# Altium project logic_board.PrjPcb
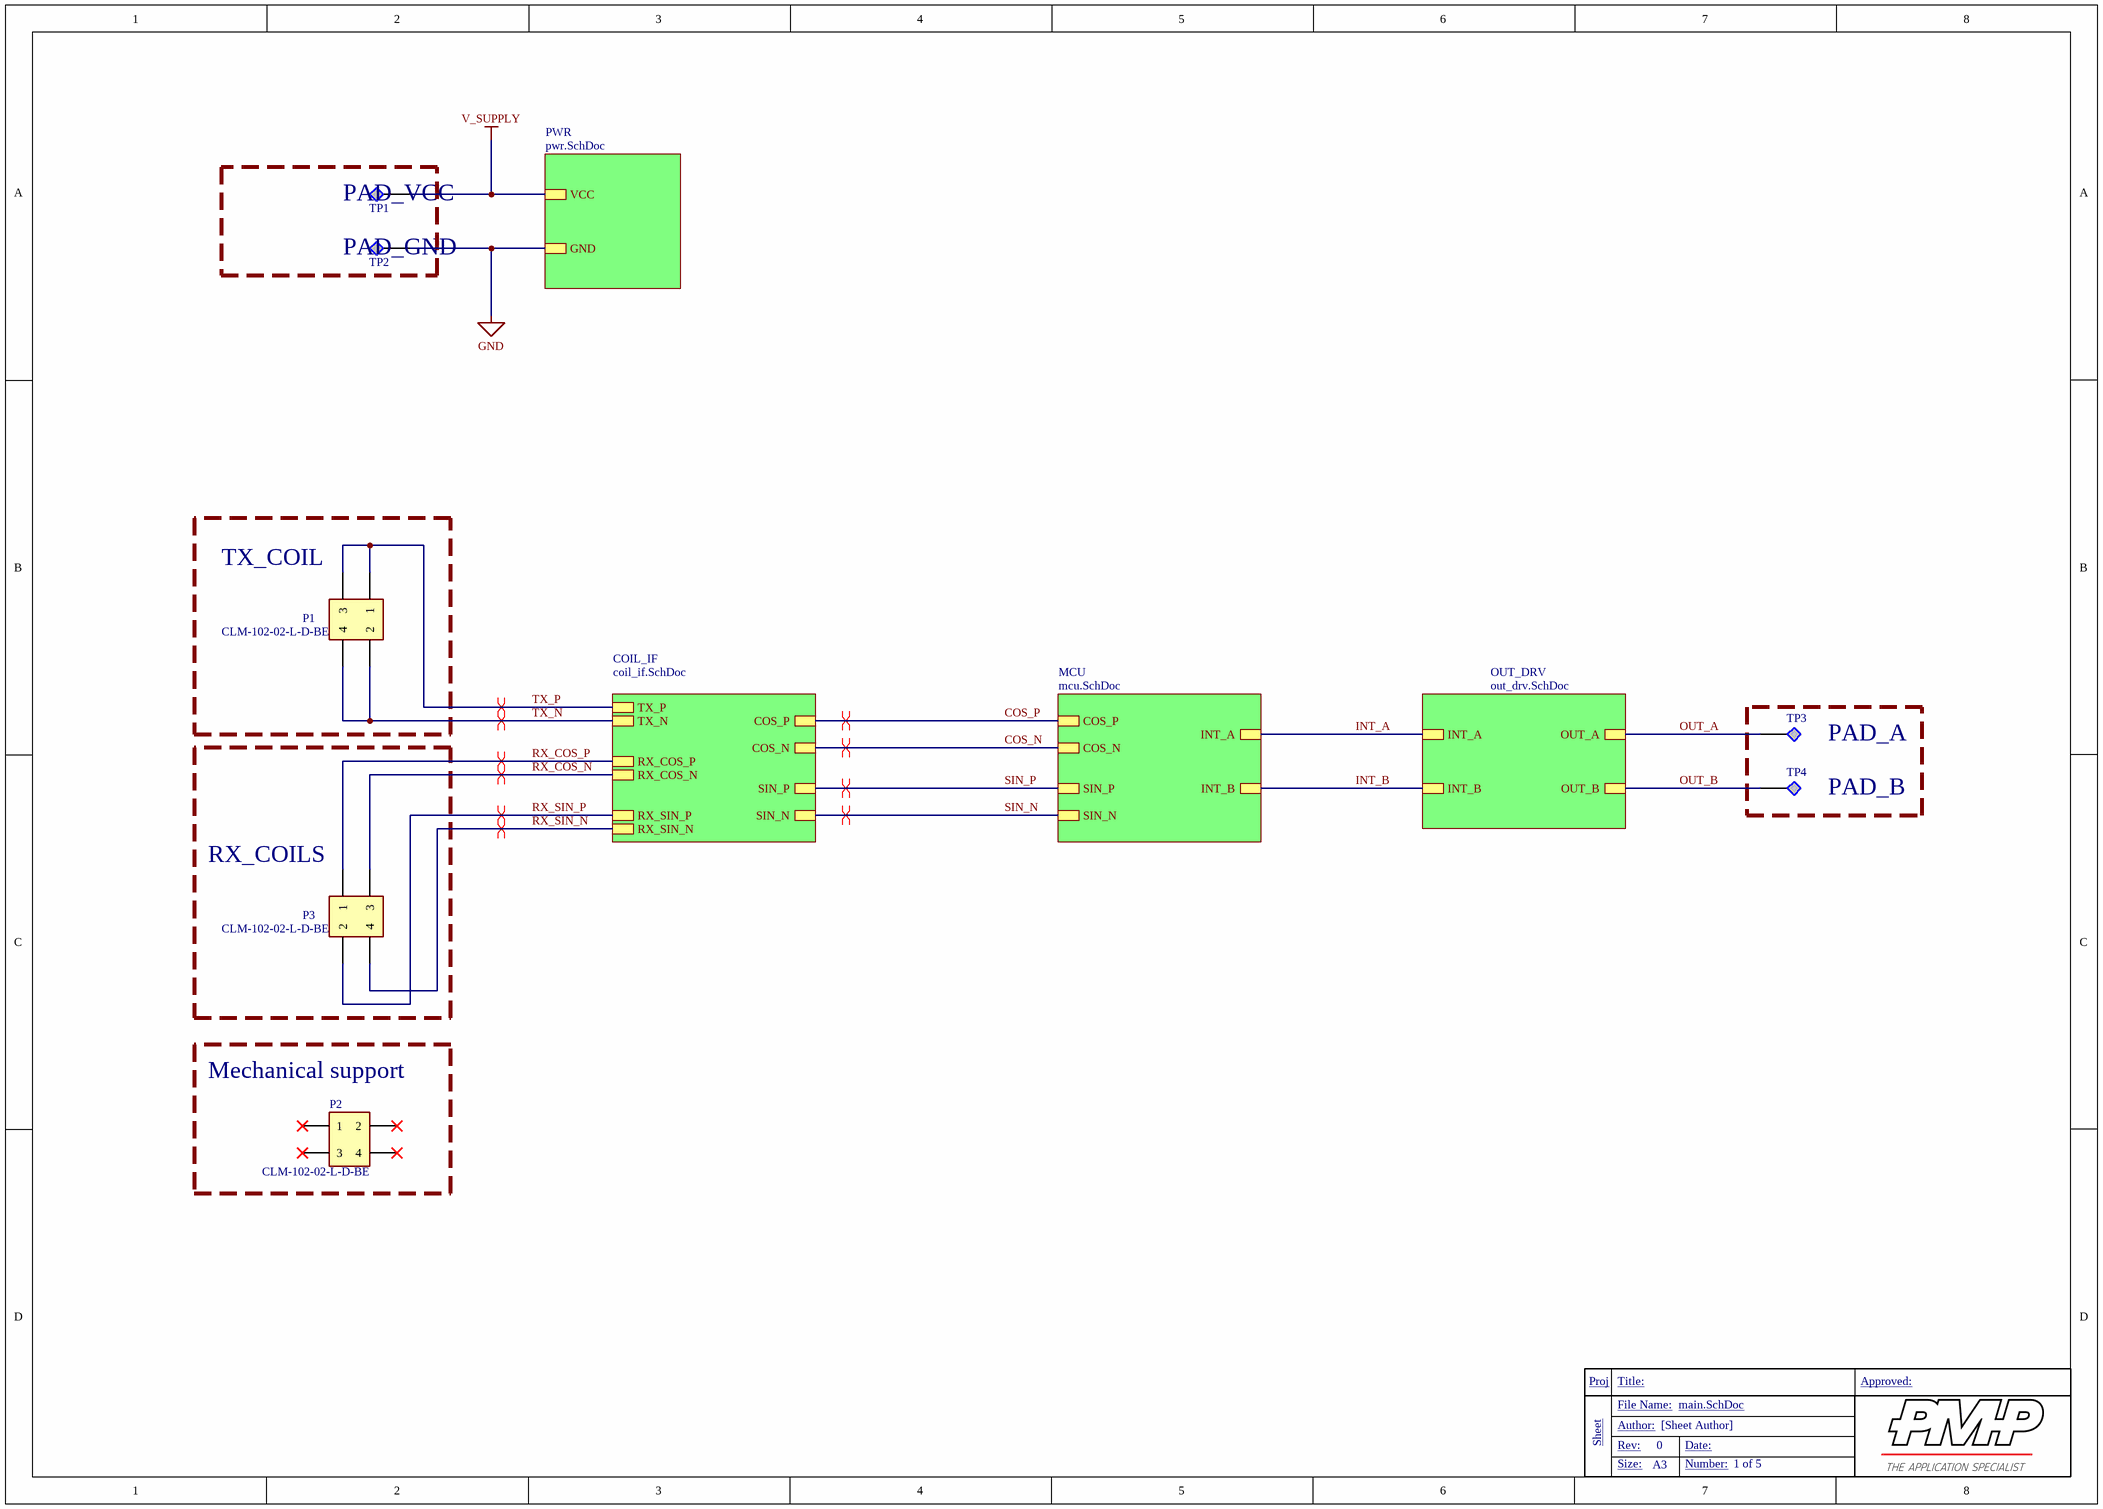
[diagram p0: main.SchDoc]
5 sheets, 71 parts. Net scope: hierarchical (ports join the sheet entries above them; power ports are global).
Board files: PCB1_w_gnd_plane.PcbDoc, PCB1_wo_gnd_plane.PcbDoc
Sheets:
  main.SchDoc
    PWR = pwr.SchDoc
    OUT_DRV = out_drv.SchDoc
    MCU = mcu.SchDoc
    COIL_IF = coil_if.SchDoc

## Sheet main.SchDoc: =ProjectName+'_'+Revision+'_'+VariantName
size A3; Author: [Sheet Author]; DocumentNumber: 1; Revision: 0; SheetNumber: 1; SheetTotal: 5

### Parts
P1  CLM-102-02-L-D-BE  [SAMTEC_CLM-102-02-X-D-BE_SPECIAL]
P2  CLM-102-02-L-D-BE  [SAMTEC_CLM-102-02-X-D-BE_SPECIAL]
P3  CLM-102-02-L-D-BE  [SAMTEC_CLM-102-02-X-D-BE_SPECIAL]
TP1  Term Pole  [Terminale 508-0685_2mm]  (value not drawn)
TP2  Term Pole  [Terminale 508-0685_2mm]  (value not drawn)
TP3  Term Pole  [Terminale 508-0685_2mm]  (value not drawn)
TP4  Term Pole  [Terminale 508-0685_2mm]  (value not drawn)

### Blocks framed on the sheet
TX_COIL: P1
RX_COILS: P3
Mechanical support: P2

### Sub-sheets
COIL_IF = coil_if.SchDoc: COS_P, COS_N, TX_P, TX_N, RX_COS_N, RX_COS_P, SIN_N, SIN_P, RX_SIN_N, RX_SIN_P
MCU = mcu.SchDoc: INT_A, INT_B, COS_P, COS_N, SIN_N, SIN_P
OUT_DRV = out_drv.SchDoc: OUT_A, OUT_B, INT_A, INT_B
PWR = pwr.SchDoc: GND, VCC

### Nets
GND: TP2.1 ; sheet PWR/GND
V_SUPPLY: TP1.1 ; sheet PWR/VCC
COS_N: sheet MCU/COS_N, sheet COIL_IF/COS_N
COS_P: sheet MCU/COS_P, sheet COIL_IF/COS_P
INT_A: sheet OUT_DRV/INT_A, sheet MCU/INT_A
INT_B: sheet OUT_DRV/INT_B, sheet MCU/INT_B
OUT_A: TP3.1 ; sheet OUT_DRV/OUT_A
OUT_B: TP4.1 ; sheet OUT_DRV/OUT_B
RX_COS_N: P3.03(3) ; sheet COIL_IF/RX_COS_N
RX_COS_P: P3.01(1) ; sheet COIL_IF/RX_COS_P
RX_SIN_N: P3.04(4) ; sheet COIL_IF/RX_SIN_N
RX_SIN_P: P3.02(2) ; sheet COIL_IF/RX_SIN_P
SIN_N: sheet MCU/SIN_N, sheet COIL_IF/SIN_N
SIN_P: sheet MCU/SIN_P, sheet COIL_IF/SIN_P
TX_N: P1.02(2) P1.04(4) ; sheet COIL_IF/TX_N
TX_P: P1.01(1) P1.03(3) ; sheet COIL_IF/TX_P

Not connected (* = marked no-connect by the designer): P2 01(1)* 02(2)* 03(3)* 04(4)*

### Layout directives
differential pair: COS_N, COS_P, RX_COS_N, RX_COS_P, RX_SIN_N, RX_SIN_P, SIN_N, SIN_P, TX_N, TX_P

### Notes on the sheet
- PAD_VCC
- PAD_GND
- PAD_A
- PAD_B
- Proj
- Title:
- Approved:
- Sheet
- File Name:
- Rev:
- Author:
- Date:
- Size:
- A3
- Number:

### Library data of the parts
P1-P3 = CLM-102-02-L-D-BE: Samtech Female header 2x2,pitch 1mm; MP: TSW-108-07-G-S; MF: Samtec; ConnType: Board 2 Board; Min Op# Temp °C: -55; Max Op# temp °C: 125; Availability: Unavailable; Package: None; Value: CLM-102-02-L-D-BE; Price: None; MPN1: CLM-102-02-L-D-BE; MFG1: Samtec; Pins: 4; Pitch: 1mm; Orientation: Vertical; Mount: SMD; Supplier: Mouser; Supplier Part Number: 200-CLM10202LDBE; Supplier URL: https://www.mouser.it/it/ProductDetail/Samtec/CLM-102-02-L-D-BE?qs=rU5fayqh%252BE2B%252BzS%2F4mx9aQ%3D%3D; Datasheet URL: https://www.mouser.it/datasheet/3/85/1/clm_sm.pdf
TP1-TP4 = 20-2137: Occhiello PTH, 1mm, Black, Plated; MFG1: Vero Tech Ltd; ConnType: TestProbe; MPN1: 20-2137; Value: Term Pole; Pins: 1; Case/Package: PTH; Orientation: Radial; Mount: TH; Supplier: RS; Supplier Part Number: 101-2391; Supplier URL: https://it.rs-online.com/web/p/morsetti-terminali/1012391?searchId=bf2eecf7-719e-4693-ba83-d06578001651&gb=s; Datasheet URL: https://docs.rs-online.com/56da/0900766b80c120b2.pdf; Color: Black

## Sheet pwr.SchDoc: =ProjectName+'_'+Revision+'_'+VariantName
size A3; Date: [Sheet Date]; Author: [Sheet Author]; DocumentNumber: 2; Revision: 0; SheetNumber: 2; SheetTotal: 5
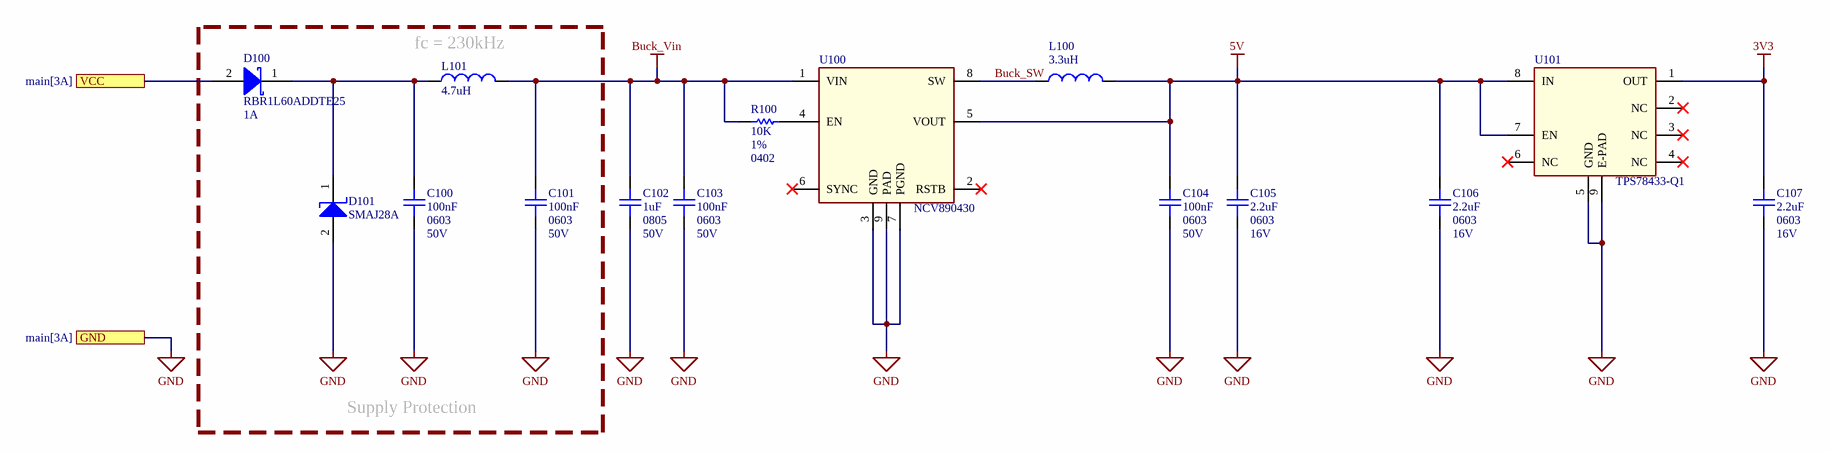
[diagram p1: pwr.SchDoc]

### Parts
C100  Case/Package: 0603  Op Voltage: 50V  [CER0603]  (hidden comment: 100nF)
C101  Case/Package: 0603  Op Voltage: 50V  [CER0603]  (hidden comment: 100nF)
C102  Case/Package: 0805  Op Voltage: 50V  [CER0805]  (hidden comment: 1uF)
C103  Case/Package: 0603  Op Voltage: 50V  [CER0603]  (hidden comment: 100nF)
C104  Case/Package: 0603  Op Voltage: 50V  [CER0603]  (hidden comment: 100nF)
C105  Case/Package: 0603  Op Voltage: 16V  [CER0603]  (hidden comment: 2.2uF)
C106  Case/Package: 0603  Op Voltage: 16V  [CER0603]  (hidden comment: 2.2uF)
C107  Case/Package: 0603  Op Voltage: 16V  [CER0603]  (hidden comment: 2.2uF)
D100  value RBR1L60ADDTE25  If (A): 1A  [DO-214AC_SMA]  (hidden comment: Shottky Rect Diode SMD)
D101  value SMAJ28A  [DO-214AC_SMA]  (hidden comment: SMD/PTH TVS Unidirectional Diode)
L100  value 3.3uH  [WE-MAPI_1212]  (hidden comment: SMD Inductor)
L101  value 4.7uH  [WE-LQ_1210]  (hidden comment: SMD Inductor)
R100  value 10K  Tolerance: 1%  Case/Package: 0402  [Res0402]  (hidden comment: SMD Resistor)
U100  value NCV890430  [SON65P300X300X100-9N]  (hidden comment: ONSEMI_NCV890430)
U101  value TPS78433-Q1  [SON65P300X100_HS-9N]  (hidden comment: TI_TPS78533Q_VSON)

### Ports
GND (see main[3A]), VCC (see main[3A])

### Nets
3V3: C107.1 U101.1(OUT)
5V: C104.1 C105.1 C106.1 L100.2 U100.5(VOUT) U101.7(EN) U101.8(IN)
Buck_Vin: C101.1 C102.1 C103.1 L101.2 R100.2 U100.1(VIN)
GND: C100.2 C101.2 C102.2 C103.2 C104.2 C105.2 C106.2 C107.2 D101.2(A) U100.3(GND) U100.7(PGND) U100.9(PAD) U101.5(GND) U101.9(E-PAD) ; port GND
V_SUPPLY: D100.2(A) ; port VCC
Buck_SW: L100.1 U100.8(SW)
NetC100_1: C100.1 D100.1(K) D101.1(K) L101.1
NetR100_1: R100.1 U100.4(EN)

Not connected (* = marked no-connect by the designer): U100 2(RSTB)* 6(SYNC)*; U101 2(NC)* 3(NC)* 4(NC)* 6(NC)*

### Notes on the sheet
- (near L101) fc = 230kHz
- Supply Protection
- Proj
- Title:
- Approved:
- Sheet
- File Name:
- Rev:
- Author:
- Date:
- Size:
- A3
- Number:

### Library data of the parts
C100 C101 C103 C104 = GCM188L81H104KA57D: MLCC Automotive, 100nF, 0603, 50V, 10%, X8L; MFG1: MURATA; Min Op# Temp °C: -55; Max Op# temp °C: 150; Qualification: AEC-Q200; MPN1: GCM188L81H104KA57D; Value: 100nF; MFG2: MURATA; MPN2: GCJ188L8EL104KA07; Tolerance: 10%; Dielectric: X8L; Supplier: Mouser; Supplier Part Number: 81-GCM188L81H104KA7D; Supplier URL: https://www.mouser.it/ProductDetail/Murata-Electronics/GCM188L81H104KA57J?qs=yTuLhIm%2Fv1CdnQNNqnCjYQ%3D%3D; Datasheet URL: https://www.mouser.it/datasheet/2/281/1/GCM188L81H104KA57_01A-3144042.pdf; Termination: Soft (GCJ); Technology: Powertrain/Safety for Automotive
C102 = KAM21KR71H105KL: MLCC Automotive, 1uF, 0805, 50V, 10%, X7R; MFG1: KYOCERA-AVX; Min Op# Temp °C: -55; Max Op# temp °C: 125; Qualification: AEC-Q200; MPN1: KAM21KR71H105KL; Value: 1uF; Tolerance: 10%; Dielectric: X7R; Supplier: Mouser; Supplier Part Number: 581-KAM21KR71H105KL; Supplier URL: https://www.mouser.it/ProductDetail/KYOCERA-AVX/08055C105K4T4A?qs=byeeYqUIh0Oh891bMlItEA%3D%3D; Datasheet URL: https://www.mouser.it/datasheet/2/40/AutoMLCC-2952695.pdf; Technology: Powertrain/Safety for Automotive
C105-C107 = GRT188C71C225KE13D: MLCC Automotive, 2.2uF, 0603, 16V, 10%, X7S; MFG1: MURATA; Min Op# Temp °C: -55; Max Op# temp °C: 125; Qualification: AEC-Q200; MPN1: GRT188C71C225KE13D; Value: 2.2uF; Tolerance: 10%; Dielectric: X7S; Supplier: Mouser; Supplier Part Number: 81-GRT188C71C225KE3D; Supplier URL: https://www.mouser.it/it/ProductDetail/Murata-Electronics/GRT188C71C225KE13D?qs=hd1VzrDQEGhlNcWcmqnE6Q%3D%3D; Datasheet URL: https://www.mouser.it/datasheet/3/76/1/GRT188C71C225KE13_01A.pdf
D100 = RBR1L60ADDTE25: Schottky Rectifier Diode 1A 60V SMA; MFG1: ROHM; Min Op# Temp °C: -55; Max Op# temp °C: 150; Qualification: AEC-Q101; MPN1: RBR1L60ADDTE25; Vreverse: 60V; Case/Package: SMA(DO-214AC); Supplier: Mouser; Supplier Part Number: 755-RBR1L60ADDTE25; Supplier URL: https://www.mouser.it/it/ProductDetail/ROHM-Semiconductor/RBR1L60ADDTE25?qs=4v%252BiZTmLVHHPf04ac7QKmA%3D%3D; Datasheet URL: https://www.rohm.com/datasheet?p=RBR1L60ADD&dist=Mouser&media=referral&source=mouser.com&campaign=Mouser
D101 = SMAJ28A-13-F: TVS Unidir 28V SMA; MPN1: SMAJ28A-13-F
L100 = 74438333033: Power Inductors - SMD WE-MAPI 3,3uH 1.1A DCR=266mOhms AECQ200; MFG1: WE; Fres (MHz): 38; Rated Current (mA): 1.85; Sat Current (mA): 2.05; Rated Voltage: 80; Min Op# Temp °C: -40; Max Op# temp °C: 125; Qualification: AEC-Q200; MPN1: 74438333033; DCR (mR): 266mOhm; Case/Package: 1212; Supplier: Mouser; Supplier Part Number: 710-74438333033; Supplier URL: https://www.mouser.it/it/ProductDetail/Wurth-Elektronik/74438333033?qs=ZB8tH5z5N7YH5nN%252BUBdrEg%3D%3D; Datasheet URL: https://www.we-online.com/components/products/datasheet/74438333033.pdf; Technology: SMD
L101 = 744032004: EMI Filtering Inductor WE-LQ SMT, 4.7uH, 490mA,; MFG1: WE; Rated Current (mA): 490; Sat Current (mA): 1250; DCR (mR): 280mOhm; Min Op# Temp °C: -40; Max Op# temp °C: 125; MPN1: 744032004; Case/Package: 1210; Supplier: Mouser; Supplier Part Number: 710-744032004; Supplier URL: https://www.mouser.it/it/ProductDetail/Wurth-Elektronik/744032004?qs=XJfXErqHgA4qekdNbV2MtQ%3D%3D; Datasheet URL: https://www.we-online.com/components/products/datasheet/744032004.pdf; Technology: SMD
R100 = CRCW040210K0FKED: Thick Film SM Chip Resistors, 10K, 0402, ±1%, 1/10W; MFG1: VISHAY; Power: 63mW; Temp# Coeffiient (PPM/C): 100; Min Op# Temp °C: -55; Max Op# temp °C: 155; Qualification: AEC-Q200; MPN1: CRCW040210K0FKED; Supplier: Mouser; Supplier Part Number: 71-CRCW0402-10K-E3; Supplier URL: https://www.mouser.it/ProductDetail/Vishay-Dale/CRCW040210K0FKED?qs=rlE3Te1NifyN3e8vvxacSw%3D%3D; Technology: Thick Film
U100 = NCV890430MW50TXG: synchronous buck converter; 3.5-37Vin; 5Vout; 600mA; MFG1: OnSemi; Frequency: 2MHz / 1MHz; Max Duty Cycle: 1; Max Input Voltage: 37V; Min Supply Voltage: 3.5V; Min Op# Temp °C: -40°C; Max Op# temp °C: 150°C; Nominal Output Voltage: 5V; Qualification: AEC-Q100; MPN1: NCV890430MW50TXG; Case/Package: DFN-8; Op Voltage: 3.5-37V; Supplier: Mouser; Supplier Part Number: 863-NCV890430MW50TXG; Supplier URL: https://www.mouser.it/it/ProductDetail/onsemi/NCV890430MW50TXG?qs=OycAS1CGnlh8h8gdwAjytg%3D%3D; Datasheet URL: https://www.onsemi.com/download/data-sheet/pdf/ncv890430-d.pdf; ComponentType: DCDC converter; Max Ouput Current: 600mA; Max Supply Voltage (DC): 37V; Min Input Voltage: 3.5V; Switching Frequency: 2MHz / 1MHz
U101 = TPS78433QWDRBRQ1: TPS784-Q1 Automotive, 3.3V, 300mA, High-PSRR LDO; MFG1: TI; Vin Min (V): 1.7; Vin Max (V): 6V; Out Voltage Accuracy: 0.5%; Dropout @ Imax (V): 0.08; Quiescent cuttent(uA): 25; Min Op# Temp °C: -40; Max Op# temp °C: 150; Qualification: AEC-Q100; MPN1: TPS78433QWDRBRQ1; Case/Package: WSON-8 3x3; Imax (mA): 300mA; Output Type: 3.3V; Supplier: Mouser; Supplier Part Number: 595-TPS78433QWDRBRQ1; Supplier URL: https://www.mouser.it/ProductDetail/Texas-Instruments/TPS78433QWDRBRQ1?qs=iLbezkQI%252BsgJRXPFYNHjvQ%3D%3D; Datasheet URL: https://www.ti.com/lit/gpn/tps784-q1

## Sheet out_drv.SchDoc: =ProjectName+'_'+Revision+'_'+VariantName
size A3; Date: [Sheet Date]; Author: [Sheet Author]; DocumentNumber: 5; Revision: 0; SheetNumber: 5; SheetTotal: 5
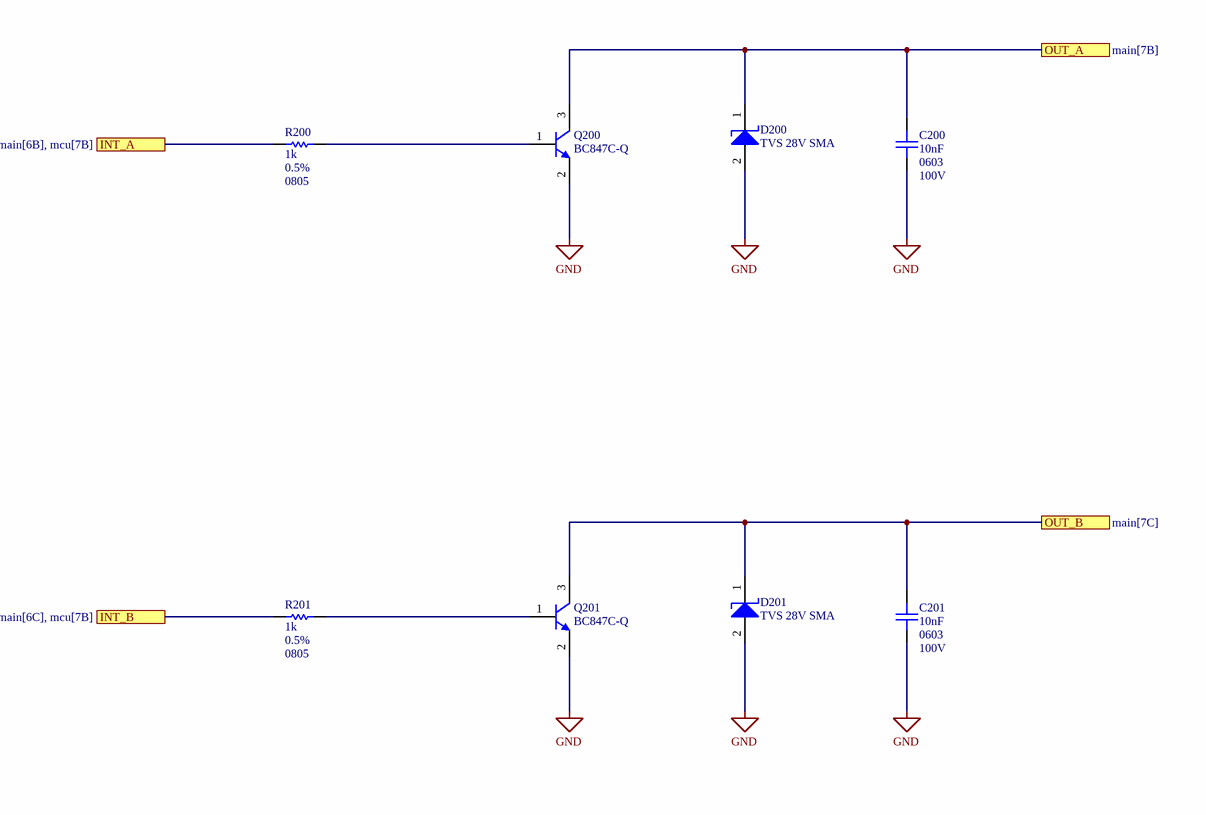
[diagram p2: out_drv.SchDoc, left]

### Parts
C200  Case/Package: 0603  Op Voltage: 100V  [CER0603]  (hidden comment: 10nF)
C201  Case/Package: 0603  Op Voltage: 100V  [CER0603]  (hidden comment: 10nF)
D200  value TVS 28V SMA  [DO-214AC_SMA]  (hidden comment: SMD/PTH TVS Unidirectional Diode)
D201  value TVS 28V SMA  [DO-214AC_SMA]  (hidden comment: SMD/PTH TVS Unidirectional Diode)
Q200  value BC847C-Q  [SOT95P230X110-3N]  (hidden comment: NPN Transistor SMD)
Q201  value BC847C-Q  [SOT95P230X110-3N]  (hidden comment: NPN Transistor SMD)
R200  value 1k  Tolerance: 0.5%  Case/Package: 0805  [Res0603]  (hidden comment: SMD Resistor)
R201  value 1k  Tolerance: 0.5%  Case/Package: 0805  [Res0603]  (hidden comment: SMD Resistor)

### Ports
INT_A (see main[6B], mcu[7B]), INT_B (see main[6C], mcu[7B]), OUT_A (see main[7B]), OUT_B (see main[7C])

### Nets
GND: C200.2 C201.2 D200.2(A) D201.2(A) Q200.2(E) Q201.2(E)
INT_A: R200.1 ; port INT_A
INT_B: R201.1 ; port INT_B
OUT_A: C200.1 D200.1(K) Q200.3(C) ; port OUT_A
OUT_B: C201.1 D201.1(K) Q201.3(C) ; port OUT_B
NetQ200_1: Q200.1(B) R200.2
NetQ201_1: Q201.1(B) R201.2

### Notes on the sheet
- Proj
- Title:
- Approved:
- Sheet
- File Name:
- Rev:
- Author:
- Date:
- Size:
- A3
- Number:

### Library data of the parts
C200 C201 = GCM188R72A103KA37: MLCC Automotive, 10nF, 0603, 100V, 10%, X7R; MFG1: MURATA; Min Op# Temp °C: -55; Max Op# temp °C: 125; Qualification: AEC-Q200; MPN1: GCM188R72A103KA37; Value: 10nF; Tolerance: 10%; Dielectric: X7R; Supplier: Mouser; Supplier Part Number: 81-GCM188R72A103KA7D; Supplier URL: https://www.mouser.it/ProductDetail/Murata-Electronics/GCM188R72A103KA37D?qs=aEuGZpxfbxXMjTExujWHsg%3D%3D; Datasheet URL: https://www.mouser.it/datasheet/2/281/1/GCM188R72A103KA37_01C-3144519.pdf; Technology: Powertrain/Safety for Automotive
D200 D201 = SMA6T28AY: TVS Uniir 28V SMA; MFG1: ST; 10/1000us Power: 0.6Kw; 8/20us Power: 4KW; Stand-Off Voltage: 24V; Min Op# Temp °C: -55; Max Op# temp °C: 150; Qualification: AEC-Q101; MPN1: SMA6T28AY; Case/Package: SMA/DO-214AC; Type: Unidirectional; Supplier: Mouser; Supplier Part Number: 511-SMA6T28AY; Supplier URL: https://www.mouser.it/ProductDetail/STMicroelectronics/SMAJ30A-TR?qs=zr%2F4QzOm779pW41kykOibw%3D%3D; Datasheet URL: https://www.mouser.it/datasheet/2/389/sma6ty-1850088.pdf
Q200 Q201 = NEXPERIA: NPN general purpose transistors; MPN1: BC847C-QR; Vce Max (V): 45; Ic (mA): 100; Hfe (min): 520; Power Diss (mW): 250; Min Op# Temp °C: -65; Max Op# temp °C: 150; Qualification: AEC-Q101; Manufacturer: *; PN: *; MFG1: NEXPERIA; MFG2: Diodes; MPN2: BC847C-Q; Case/Package: SOT23-3; Type: NPN; Supplier: Mouser; Supplier Part Number: 771-BC847C-QR; Supplier URL: https://www.mouser.it/ProductDetail/Nexperia/BC847C-QR?qs=e8oIoAS2J1RqA3Lgar2wrA%3D%3D; Manufacturer URL: https://www.nexperia.com/search?q=BC847C-Q&searchCategory=
R200 R201 = ERJ-UP6D1001V: Thick Film SM Chip Resistors, 1K, 0805, ±0.5%, 1/2W; MFG1: PANASONIC; Power: 500mW; Temp# Coeffiient (PPM/C): 100; Min Op# Temp °C: -55; Max Op# temp °C: 155; Qualification: AEC-Q200; MPN1: ERJ-UP6D1001V; Supplier: Mouser; Supplier Part Number: 667-ERJ-UP6D1001V; Supplier URL: https://www.mouser.it/ProductDetail/Panasonic/ERJ-UP6D1001V?qs=sGAEpiMZZMvdGkrng054t2cqbZCzJY7NErLgAwiDoTXwln0CjOTO8w%3D%3D; Datasheet URL: https://www.mouser.com/catalog/specsheets/Panasonic_03-31-2024_Resistor_Anti-Sulfur(ERJ-UP6D-Series).pdf?_gl=1*1e8nwi8*_gcl_aw*R0NMLjE3Njc5NTQ2NTkuQ2p3S0NBaUE2NExMQmhCaEVpd0EtUHhndXhkNEYtbVB4TUc1OThEMlhWWVZvVEZGVXVGM1djYmUtdlk1a3VMZFRfZGNHclBMelhFSjRSb0NH; Technology: Thick Film

## Sheet mcu.SchDoc: =ProjectName+'_'+Revision+'_'+VariantName
size A3; Date: [Sheet Date]; Author: [Sheet Author]; DocumentNumber: 4; Revision: 0; SheetNumber: 4; SheetTotal: 5
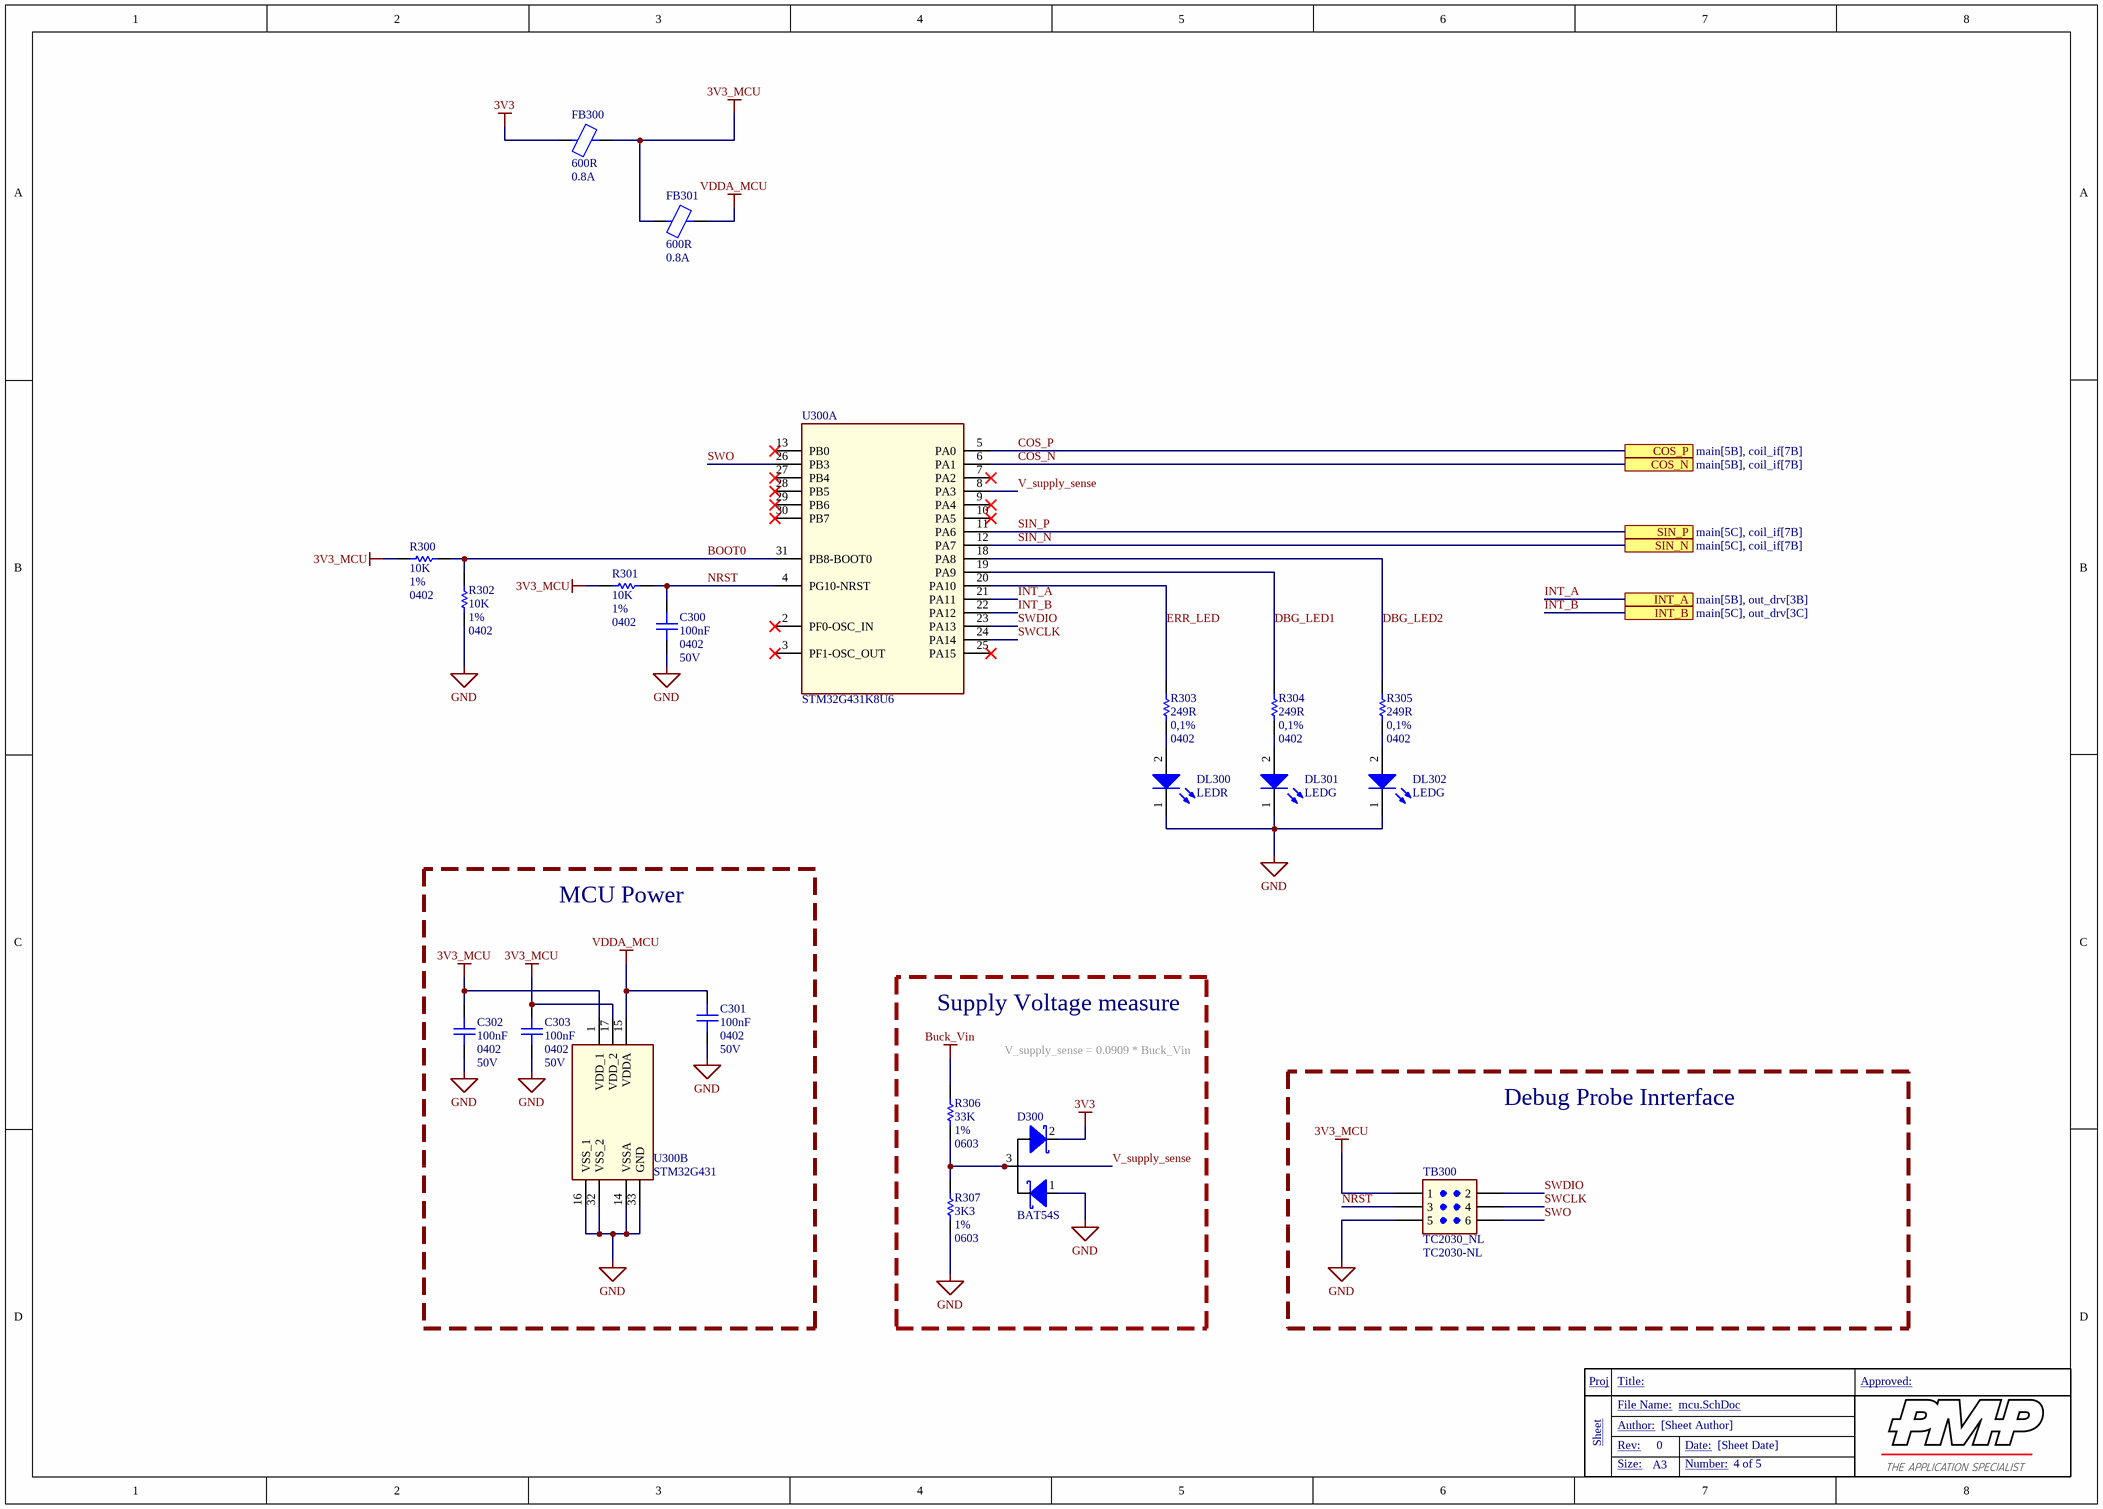
[diagram p3: mcu.SchDoc]

### Parts
C300  Case/Package: 0402  Op Voltage: 50V  [CER0402]  (hidden comment: 100nF)
C301  Case/Package: 0402  Op Voltage: 50V  [CER0402]  (hidden comment: 100nF)
C302  Case/Package: 0402  Op Voltage: 50V  [CER0402]  (hidden comment: 100nF)
C303  Case/Package: 0402  Op Voltage: 50V  [CER0402]  (hidden comment: 100nF)
D300  value BAT54S  [SOT95P230X110-3N]  (hidden comment: Double Schottky Diode, SOT23-3 series)
DL300  value LEDR  [LED SMD 0603]  (hidden comment: Single Color SMD LED)
DL301  value LEDG  [LED SMD 0603]  (hidden comment: Single Color SMD LED)
DL302  value LEDG  [LED SMD 0603]  (hidden comment: Single Color SMD LED)
FB300  Impedence @100MHz: 600R  Rated Current @85°C: 0.8A  [FEB0603]
FB301  Impedence @100MHz: 600R  Rated Current @85°C: 0.8A  [FEB0603]
R300  value 10K  Tolerance: 1%  Case/Package: 0402  [Res0402]  (hidden comment: SMD Resistor)
R301  value 10K  Tolerance: 1%  Case/Package: 0402  [Res0402]  (hidden comment: SMD Resistor)
R302  value 10K  Tolerance: 1%  Case/Package: 0402  [Res0402]  (hidden comment: SMD Resistor)
R303  value 249R  Tolerance: 0,1%  Case/Package: 0402  [Res0402]  (hidden comment: SMD Resistor)
R304  value 249R  Tolerance: 0,1%  Case/Package: 0402  [Res0402]  (hidden comment: SMD Resistor)
R305  value 249R  Tolerance: 0,1%  Case/Package: 0402  [Res0402]  (hidden comment: SMD Resistor)
R306  value 33K  Tolerance: 1%  Case/Package: 0603  [Res0603]  (hidden comment: SMD Resistor)
R307  value 3K3  Tolerance: 1%  Case/Package: 0603  [Res0603]  (hidden comment: SMD Resistor)
TB300  TC2030_NL  value TC2030-NL  [TC2030_NL]
U300  STM32G431K8U6  [QFN50P500X500X60-33N]  (parts A,B of 2)

### Blocks framed on the sheet
MCU Power: C301-C303 U300
Supply Voltage measure: D300 R306 R307
Debug Probe Inrterface: TB300

### Ports
COS_N (see main[5B], coil_if[7B]), COS_P (see main[5B], coil_if[7B]), INT_A (see main[5B], out_drv[3B]), INT_B (see main[5C], out_drv[3C]), SIN_N (see main[5C], coil_if[7B]), SIN_P (see main[5C], coil_if[7B])

### Nets
3V3: D300.2(K2) FB300.1
3V3_MCU: C302.1 C303.1 FB300.2 FB301.1 R300.2 R301.2 TB300.1 U300.1(VDD_1) U300.17(VDD_2)
Buck_Vin: R306.2
GND: C300.2 C301.2 C302.2 C303.2 D300.1(A1) DL300.1(K) DL301.1(K) DL302.1(K) R302.1 R307.1 TB300.5 U300.14(VSSA) U300.16(VSS_1) U300.32(VSS_2) U300.33(GND)
VDDA_MCU: C301.1 FB301.2 U300.15(VDDA)
BOOT0: R300.1 R302.2 U300.31(PB8-BOOT0)
COS_N: U300.6(PA1) ; port COS_N
COS_P: U300.5(PA0) ; port COS_P
DBG_LED1: R304.2 U300.19(PA9)
DBG_LED2: R305.2 U300.18(PA8)
ERR_LED: R303.2 U300.20(PA10)
INT_A: U300.21(PA11) ; port INT_A
INT_B: U300.22(PA12) ; port INT_B
NRST: C300.1 R301.1 TB300.3 U300.4(PG10-NRST)
SIN_N: U300.12(PA7) ; port SIN_N
SIN_P: U300.11(PA6) ; port SIN_P
SWCLK: TB300.4 U300.24(PA14)
SWDIO: TB300.2 U300.23(PA13)
SWO: TB300.6 U300.26(PB3)
V_supply_sense: D300.3(C) R306.1 R307.2 U300.8(PA3)
NetDL300_2: DL300.2(A) R303.1
NetDL301_2: DL301.2(A) R304.1
NetDL302_2: DL302.2(A) R305.1

Not connected (* = marked no-connect by the designer): U300 2(PF0-OSC_IN)* 3(PF1-OSC_OUT)* 7(PA2)* 9(PA4)* 10(PA5)* 13(PB0)* 25(PA15)* 27(PB4)* 28(PB5)* 29(PB6)* 30(PB7)*

### Notes on the sheet
- V_supply_sense = 0.0909 * Buck_Vin
- Proj
- Title:
- Approved:
- Sheet
- File Name:
- Rev:
- Author:
- Date:
- Size:
- A3
- Number:

### Library data of the parts
C300-C303 = GCM155R71H104KE02D: MLCC Automotive, 100nF, 0402, 50V, 10%, X7r; MFG1: MURATA; Min Op# Temp °C: -55; Max Op# temp °C: 125; Qualification: AEC-Q200; MPN1: GCM155R71H104KE02D; Value: 100nF; MFG2: MURATA; MPN2: GCM155R71H104KE37; Tolerance: 10%; Dielectric: X7R; Supplier: Mouser; Supplier Part Number: 81-GCM155R71H104KE2D; Supplier URL: https://www.mouser.it/ProductDetail/Murata-Electronics/GCM155R71H104KE02D?qs=hNud%2FORuBR2sLZsqfoz4Fw%3D%3D; Datasheet URL: https://www.mouser.it/datasheet/2/281/1/GCM155R71H104KE02_01A-3142168.pdf; Technology: Powertrain/Safety for Automotive
D300 = BAT54S: Dual Schottky Diode,  Dual Series, SOT23, 0.2A, 30V; MFG1: NEXPERIA; If (A): 0.2; Type: Dual Series A1K2C; MPN1: BAT54S; MFG2: OnSemi; MPN2: BAT54SLT1G; Vreverse: 30V; Case/Package: SOT323-3 (SC70)
DL300 = SML-D12U8WT86C: LED standard - SMD Red 620nm 63mcd 2.2 V, 20mA, 0603 AECQ-102; MFG1: ROHM; Vf: 2V @4mA; Max Current@ Tmax: 4mA; Power Diss (mW): 54mW; Min Op# Temp °C: -40; Max Op# temp °C: 100; Qualification: AEC-Q101; MPN1: SML-D12U8WT86C; Case/Package: 0603-Top View; Color: red 620nm; Supplier: Mouser; Supplier Part Number: 755-SML-D12U8WT86C; Supplier URL: https://www.mouser.it/ProductDetail/ROHM-Semiconductor/SML-D12U8WT86C?qs=HXFqYaX1Q2wNcb%2FPJz96zg%3D%3D; Datasheet URL: https://fscdn.rohm.com/en/products/databook/datasheet/opto/led/chip_mono/sml-d12u8wt86(c)-e.pdf; Technology: SM
DL301 DL302 = SML-D12P8WT86C: LED standard - SMD Grn 560nm 6.3mcd 2.2 V, 20mA, 0603 AECQ-102; MFG1: ROHM; Vf: 2V @4mA; Max Current@ Tmax: 4mA; Power Diss (mW): 54mW; Min Op# Temp °C: -40; Max Op# temp °C: 100; Qualification: AEC-Q101; MPN1: SML-D12P8WT86C; Case/Package: 0603-Top View; Color: Green 560nm; Supplier: Mouser; Supplier Part Number: 755-SML-D12P8WT86C; Supplier URL: https://www.mouser.it/ProductDetail/ROHM-Semiconductor/SML-D12P8WT86C?qs=HXFqYaX1Q2wFepzn1zWRrg%3D%3D; Datasheet URL: https://fscdn.rohm.com/en/products/databook/datasheet/opto/led/chip_mono/sml-d12p8wt86(c)-e.pdf; Technology: SM
FB300 FB301 = BLM18HE601SH1D: SMD EMI Suppression Ferrite Bead 600R, 0603, For DC Power; MFG1: MURATA; Rated Current @125°C: 0.6A; DCR (mR): 125; Min Op# Temp °C: -55; MPN1: BLM18HE601SH1D; Impedence @1GHz: 600R; Case/Package: 0603; Supplier: Mouser; Supplier Part Number: 81-BLM18HE601SH1D; Supplier URL: https://www.mouser.it/ProductDetail/Murata-Electronics/BLM18HE601SH1D?qs=d0WKAl%252BL4KZJDOgHon8ecQ%3D%3D; Datasheet URL: https://www.murata.com/products/productdata/8796199452702/QNFA9104.pdf?1539737628000; Max Op# temp °C: 125; Technology: AEC-Q200
R300-R302 = CRCW040210K0FKED: as R100 on sheet pwr; MPN1: CRCW040210K0FKED; Supplier: Mouser; Supplier Part Number: 71-CRCW0402-10K-E3; Supplier URL: https://www.mouser.it/ProductDetail/Vishay-Dale/CRCW040210K0FKED?qs=rlE3Te1NifyN3e8vvxacSw%3D%3D; Technology: Thick Film
R303-R305 = TNPW0402249RBYEP: Thick Film SM Chip Resistors, 249R, 0402, ±0.1%, 10ppm 1/16W; MFG1: VISHAY; Power: 63mW; Temp# Coeffiient (PPM/C): 10; Min Op# Temp °C: -55; Max Op# temp °C: 155; Qualification: AEC-Q200; MPN1: TNPW0402249RBYEP; Supplier: Mouser; Supplier Part Number: 71-TNPW0402249RBYEP; Supplier URL: https://www.mouser.it/ProductDetail/Vishay-Dale/TNPW0402249RBYEP?qs=iLbezkQI%252Bsgmf6IA3nvojA%3D%3D; Technology: Thick Film
R306 = CRCW060333K0FKEA: Thick Film SM Chip Resistors, 33K, 0603, ±1%, 1/10W; MFG1: VISHAY; Power: 100mW; Temp# Coeffiient (PPM/C): 100; Min Op# Temp °C: -55; Max Op# temp °C: 155; Qualification: AEC-Q200; MPN1: CRCW060333K0FKEA; Supplier: Mouser; Supplier Part Number: 71-CRCW0603-33K-E3; Supplier URL: https://www.mouser.it/ProductDetail/Vishay-Dale/CRCW060333K0FKEA?qs=lRdAfIXKPc%2FlOd6gcmC8oQ%3D%3D; Technology: Thick Film
R307 = CRCW06033K30FKEA: Thick Film SM Chip Resistors, 3K3, 0603, ±1%, 1/10W; MFG1: VISHAY; Power: 100mW; Temp# Coeffiient (PPM/C): 100; Min Op# Temp °C: -55; Max Op# temp °C: 155; Qualification: AEC-Q200; MPN1: CRCW06033K30FKEA; Supplier: Mouser; Supplier Part Number: 71-CRCW0603-3.3K-E3; Supplier URL: https://www.mouser.it/ProductDetail/Vishay-Dale/CRCW06033K30FKEA?qs=1ghF3ZI8kS8fRqapjAj84Q%3D%3D&gad_source=1&gclid=EAIaIQobChMI4J_M0IWohAMVrUNBAh1qNACkEAAYBCAAEgIV-vD_BwE; Technology: Thick Film
TB300 = TC2030-NL: SWDIO pogo pin connector pads; MFG1: TAG_CONNECT; Pitch: 1.27mm; ConnType: Board 2 Wire; MPN1: TC2030-NL; Orientation: Vertical; Terminal Type: Exposed Pads
U300 = STM32G431K8U6: MCU  Arm Cortex-M4 MCU 170 MHz -64 KB Flash; Manufacturer_Name: STMicroelectronics; Geometry.Height: 0.6mm; Mouser Part Number: 511-STM32G431K8U6; Mouser Price/Stock: https://www.mouser.co.uk/ProductDetail/STMicroelectronics/STM32G431K8U6?qs=sPbYRqrBIVmxpguskjGNNg%3D%3D; Manufacturer_Part_Number: STM32G431K8U6; Datasheet Link: https://www.st.com/resource/en/datasheet/stm32g431c6.pdf; MPN1: STM32G431K8U6; Value: STM32G431; MFG1: STMicroelectronics; Case/Package: QFN32

## Sheet coil_if.SchDoc: =ProjectName+'_'+Revision+'_'+VariantName
size A3; Date: [Sheet Date]; Author: [Sheet Author]; DocumentNumber: 3; Revision: 0; SheetNumber: 3; SheetTotal: 5
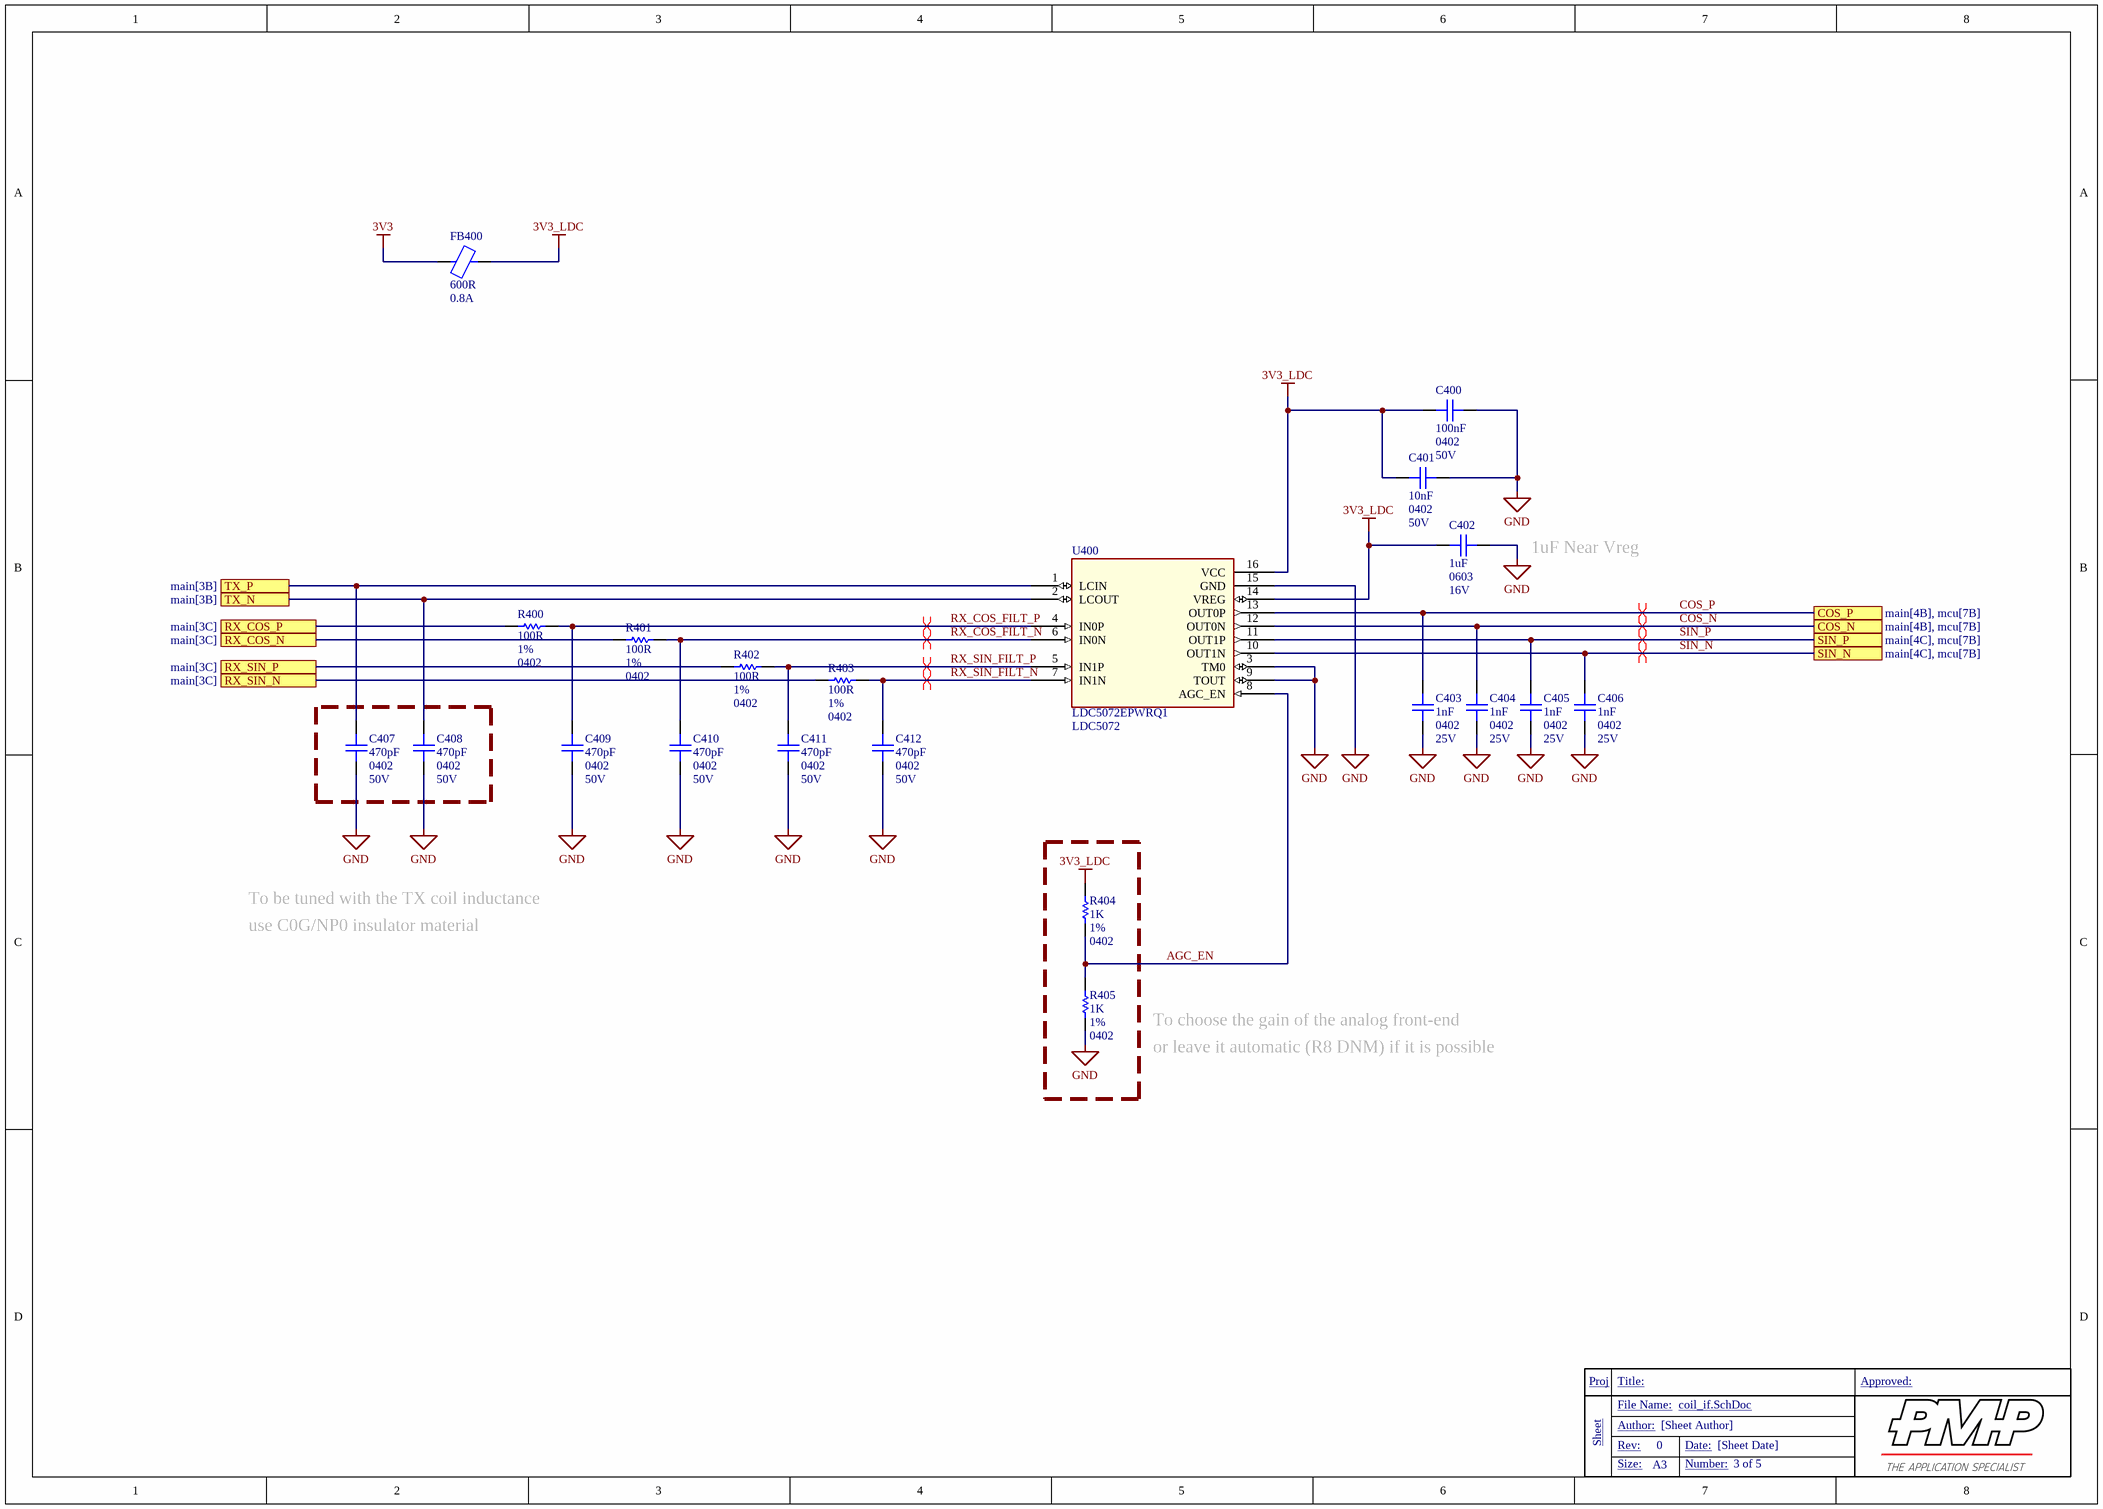
[diagram p4: coil_if.SchDoc]

### Parts
C400  Case/Package: 0402  Op Voltage: 50V  [CER0402]  (hidden comment: 100nF)
C401  Case/Package: 0402  Op Voltage: 50V  [CER0402]  (hidden comment: 10nF)
C402  Case/Package: 0603  Op Voltage: 16V  [CER0603]  (hidden comment: 1uF)
C403  Case/Package: 0402  Op Voltage: 25V  [CER0402]  (hidden comment: 1nF)
C404  Case/Package: 0402  Op Voltage: 25V  [CER0402]  (hidden comment: 1nF)
C405  Case/Package: 0402  Op Voltage: 25V  [CER0402]  (hidden comment: 1nF)
C406  Case/Package: 0402  Op Voltage: 25V  [CER0402]  (hidden comment: 1nF)
C407  Case/Package: 0402  Op Voltage: 50V  [CER0402]  (hidden comment: 470pF)
C408  Case/Package: 0402  Op Voltage: 50V  [CER0402]  (hidden comment: 470pF)
C409  Case/Package: 0402  Op Voltage: 50V  [CER0402]  (hidden comment: 470pF)
C410  Case/Package: 0402  Op Voltage: 50V  [CER0402]  (hidden comment: 470pF)
C411  Case/Package: 0402  Op Voltage: 50V  [CER0402]  (hidden comment: 470pF)
C412  Case/Package: 0402  Op Voltage: 50V  [CER0402]  (hidden comment: 470pF)
FB400  Impedence @100MHz: 600R  Rated Current @85°C: 0.8A  [FEB0603]
R400  value 100R  Tolerance: 1%  Case/Package: 0402  [Res0402]  (hidden comment: SMD Resistor)
R401  value 100R  Tolerance: 1%  Case/Package: 0402  [Res0402]  (hidden comment: SMD Resistor)
R402  value 100R  Tolerance: 1%  Case/Package: 0402  [Res0402]  (hidden comment: SMD Resistor)
R403  value 100R  Tolerance: 1%  Case/Package: 0402  [Res0402]  (hidden comment: SMD Resistor)
R404  value 1K  Tolerance: 1%  Case/Package: 0402  [Res0402]  (hidden comment: SMD Resistor)
R405  value 1K  Tolerance: 1%  Case/Package: 0402  [Res0402]  (hidden comment: SMD Resistor)
U400  LDC5072EPWRQ1  value LDC5072  [TSSOP16-PW_TEX]

### Ports
COS_N (see main[4B], mcu[7B]), COS_P (see main[4B], mcu[7B]), RX_COS_N (see main[3C]), RX_COS_P (see main[3C]), RX_SIN_N (see main[3C]), RX_SIN_P (see main[3C]), SIN_N (see main[4C], mcu[7B]), SIN_P (see main[4C], mcu[7B]), TX_N (see main[3B]), TX_P (see main[3B])

### Nets
3V3: FB400.1
3V3_LDC: C400.1 C401.1 C402.1 FB400.2 R404.2 U400.14(VREG) U400.16(VCC)
GND: C400.2 C401.2 C402.2 C403.2 C404.2 C405.2 C406.2 C407.2 C408.2 C409.2 C410.2 C411.2 C412.2 R405.1 U400.3(TM0) U400.9(TOUT) U400.15(GND)
AGC_EN: R404.1 R405.2 U400.8(AGC_EN)
COS_N: C404.1 U400.12(OUT0N) ; port COS_N
COS_P: C403.1 U400.13(OUT0P) ; port COS_P
RX_COS_FILT_N: C410.1 R401.2 U400.6(IN0N)
RX_COS_FILT_P: C409.1 R400.2 U400.4(IN0P)
RX_COS_N: R401.1 ; port RX_COS_N
RX_COS_P: R400.1 ; port RX_COS_P
RX_SIN_FILT_N: C412.1 R403.2 U400.7(IN1N)
RX_SIN_FILT_P: C411.1 R402.2 U400.5(IN1P)
RX_SIN_N: R403.1 ; port RX_SIN_N
RX_SIN_P: R402.1 ; port RX_SIN_P
SIN_N: C406.1 U400.10(OUT1N) ; port SIN_N
SIN_P: C405.1 U400.11(OUT1P) ; port SIN_P
TX_N: C408.1 U400.2(LCOUT) ; port TX_N
TX_P: C407.1 U400.1(LCIN) ; port TX_P

### Layout directives
differential pair: COS_N, COS_P, RX_COS_FILT_N, RX_COS_FILT_P, RX_SIN_FILT_N, RX_SIN_FILT_P, SIN_N, SIN_P

### Notes on the sheet
- 1uF Near Vreg
- To be tuned with the TX coil inductance
- use C0G/NP0 insulator material
- To choose the gain of the analog front-end
- or leave it automatic (R8 DNM) if it is possible
- Proj
- Title:
- Approved:
- Sheet
- File Name:
- Rev:
- Author:
- Date:
- Size:
- A3
- Number:

### Library data of the parts
C400 = GCM155R71H104KE02D: as C300 on sheet mcu; MPN1: GCM155R71H104KE02D; Value: 100nF; MFG2: MURATA; MPN2: GCM155R71H104KE37; Tolerance: 10%; Dielectric: X7R; Supplier: Mouser; Supplier Part Number: 81-GCM155R71H104KE2D; Supplier URL: https://www.mouser.it/ProductDetail/Murata-Electronics/GCM155R71H104KE02D?qs=hNud%2FORuBR2sLZsqfoz4Fw%3D%3D; Datasheet URL: https://www.mouser.it/datasheet/2/281/1/GCM155R71H104KE02_01A-3142168.pdf; Technology: Powertrain/Safety for Automotive
C401 = GCM155R71H103KA55*: MLCC Automotive, 10nF, 0402, 25V, 10%, X7r; MFG1: MURATA; Min Op# Temp °C: -55; Max Op# temp °C: 125; Qualification: AEC-Q200; MPN1: GCM155R71H103KA55*; Value: 10nF; Tolerance: 10%; Dielectric: X7R; Supplier: Mouser; Supplier Part Number: 81-GCM155R71H103KA5J; Supplier URL: https://www.mouser.it/ProductDetail/Murata-Electronics/GCM155R71H103KA55J?qs=N3Kl9KD794RolAwdnyzU1Q%3D%3D; Datasheet URL: https://www.mouser.it/datasheet/2/281/1/GCM155R71H103KA55_01A-3142380.pdf; Technology: Powertrain/Safety for Automotive
C402 = GCM188R71C105KA64J: MLCC Automotive, 1uF, 0603, 16V, 10%, X7R; MFG1: MURATA; Min Op# Temp °C: -55; Max Op# temp °C: 125; Qualification: AEC-Q200; MPN1: GCM188R71C105KA64J; Value: 1uF; MFG2: KEMET; MPN2: C0603C105K4RACAUTO; Tolerance: 10%; Dielectric: X7R; Supplier: Mouser; Supplier Part Number: 81-GCM188R71C105KA4J; Supplier URL: https://www.mouser.it/ProductDetail/Murata-Electronics/GCM188R71C105KA64J?qs=4%252BGqC78dy0BN5WaW5TLgXw%3D%3D; Datasheet URL: https://www.mouser.it/datasheet/2/281/1/GCM188R71C105KA64_04A-3143889.pdf; Technology: Powertrain/Safety for Automotive
C403-C406 = GRT1555C1E102JA02J: MLCC Automotive, 1nF, 0402, 25V, 10%, COG; MFG1: MURATA; Tolerance: 5%; Dielectric: C0G; Min Op# Temp °C: -55; Max Op# temp °C: 125; Qualification: AEC-Q200; MPN1: GRT1555C1E102JA02J; Value: 1nF; Supplier: Mouser; Supplier Part Number: 81-GRT1555C1E102JA2J; Supplier URL: https://www.mouser.it/it/ProductDetail/Murata-Electronics/GRT1555C1E102JA02J?qs=sGAEpiMZZMvsSlwiRhF8qtsGU%2FCnaNeQokeRzBpVly3nnJVQ2ndM9w%3D%3D; Datasheet URL: https://www.mouser.it/datasheet/3/76/4/GRT1555C1E102JA02_01A.pdf
C407-C412 = GCM1555C1H471JA16: MLCC Automotive, 470pF, 0402, 50V, 5%, COG; MFG1: MURATA; Min Op# Temp °C: -55; Max Op# temp °C: 125; Qualification: AEC-Q200; MPN1: GCM1555C1H471JA16; Value: 470pF; Tolerance: 5%; Dielectric: COG; Supplier: Mouser; Supplier Part Number: 81-GCM1555C1H471JA6J; Supplier URL: https://www.mouser.it/ProductDetail/Murata-Electronics/GCM1555C1H471JA16J?qs=N3Kl9KD794TXvw4%2Fs7azFA%3D%3D; Technology: Powertrain/Safety for Automotive
FB400 = BLM18HE601SH1D: as FB300 on sheet mcu; MPN1: BLM18HE601SH1D; Impedence @1GHz: 600R; Case/Package: 0603; Supplier: Mouser; Supplier Part Number: 81-BLM18HE601SH1D; Supplier URL: https://www.mouser.it/ProductDetail/Murata-Electronics/BLM18HE601SH1D?qs=d0WKAl%252BL4KZJDOgHon8ecQ%3D%3D; Datasheet URL: https://www.murata.com/products/productdata/8796199452702/QNFA9104.pdf?1539737628000; Max Op# temp °C: 125; Technology: AEC-Q200
R400-R403 = CRCW0402100RFKED: Thick Film SM Chip Resistors, 100R, 0402, ±1%, 1/16W; MFG1: VISHAY; Power: 63mW; Temp# Coeffiient (PPM/C): 100; Min Op# Temp °C: -55; Max Op# temp °C: 155; Qualification: AEC-Q200; MPN1: CRCW0402100RFKED; Supplier: Mouser; Supplier Part Number: 71-CRCW0402-100-E3; Supplier URL: https://www.mouser.it/ProductDetail/Vishay-Dale/CRCW0402100RFKED?qs=OlqPY1CiralT1EG%2F62gJpQ%3D%3D; Datasheet URL: https://www.vishay.com/docs/20035/dcrcwe3.pdf; Technology: Thick Film
R404 R405 = CRCW04021K00FKED: Thick Film SM Chip Resistors, 1K, 0402, ±1%, 1/16W; MFG1: VISHAY; Power: 63mW; Temp# Coeffiient (PPM/C): 100; Min Op# Temp °C: -55; Max Op# temp °C: 155; Qualification: AEC-Q200; MPN1: CRCW04021K00FKED; Supplier: Mouser; Supplier Part Number: 71-CRCW0402-1.0K-E3; Supplier URL: https://www.mouser.it/ProductDetail/Vishay-Dale/CRCW04021K00FKED?qs=YX%252BK5oaHNYqQ2WK%252BIAW12A%3D%3D; Technology: Thick Film
U400 = LDC5072EPWRQ1: IPS interface IC; Manufacturer_Name: Texas Instruments; MFG1: TI; Min Op# Temp °C: -40; Max Op# temp °C: 160; Qualification: AEC-Q100; Type: Specialized Sensors; Copyright: Copyright (C) 2026 Ultra Librarian. All rights reserved.; Manufacturer_Part_Number: LDC5072EPWRQ1; RefDes: RefDes; MPN1: LDC5072EPWRQ1; Case/Package: TSSOP-16; Supplier: Mouser; Supplier Part Number: 595-LDC5072EPWRQ1; Supplier URL: https://www.mouser.it/it/ProductDetail/Texas-Instruments/LDC5072EPWRQ1?qs=GBLSl2AkiruyHDEJhswGzQ%3D%3D; Datasheet URL: https://www.ti.com/lit/ds/symlink/ldc5072-q1.pdf?ts=1784869376494&ref_url=https%253A%252F%252Fwww.ti.com%252Fproduct%252FLDC5072-Q1

## Nets that join several sheets
3V3: pwr (C107.1 U101.1), mcu (D300.2 FB300.1), coil_if (FB400.1)
Buck_Vin: pwr (6 pins), mcu (R306.2)
GND: main (TP2.1), pwr (14 pins), out_drv (6 pins), mcu (15 pins), coil_if (17 pins)
V_SUPPLY: main (TP1.1), pwr (D100.2)
COS_N: mcu (U300.6), coil_if (C404.1 U400.12)
COS_P: mcu (U300.5), coil_if (C403.1 U400.13)
INT_A: out_drv (R200.1), mcu (U300.21)
INT_B: out_drv (R201.1), mcu (U300.22)
OUT_A: main (TP3.1), out_drv (C200.1 D200.1 Q200.3)
OUT_B: main (TP4.1), out_drv (C201.1 D201.1 Q201.3)
RX_COS_N: main (P3.03), coil_if (R401.1)
RX_COS_P: main (P3.01), coil_if (R400.1)
RX_SIN_N: main (P3.04), coil_if (R403.1)
RX_SIN_P: main (P3.02), coil_if (R402.1)
SIN_N: mcu (U300.12), coil_if (C406.1 U400.10)
SIN_P: mcu (U300.11), coil_if (C405.1 U400.11)
TX_N: main (P1.02 P1.04), coil_if (C408.1 U400.2)
TX_P: main (P1.01 P1.03), coil_if (C407.1 U400.1)

## Assembly variants
Base: not fitted R? R? R? TP1 TP2 TP? TP?